# EAGLE schematic DA_uno_shield_3_0 (EAGLE 7.5.0)
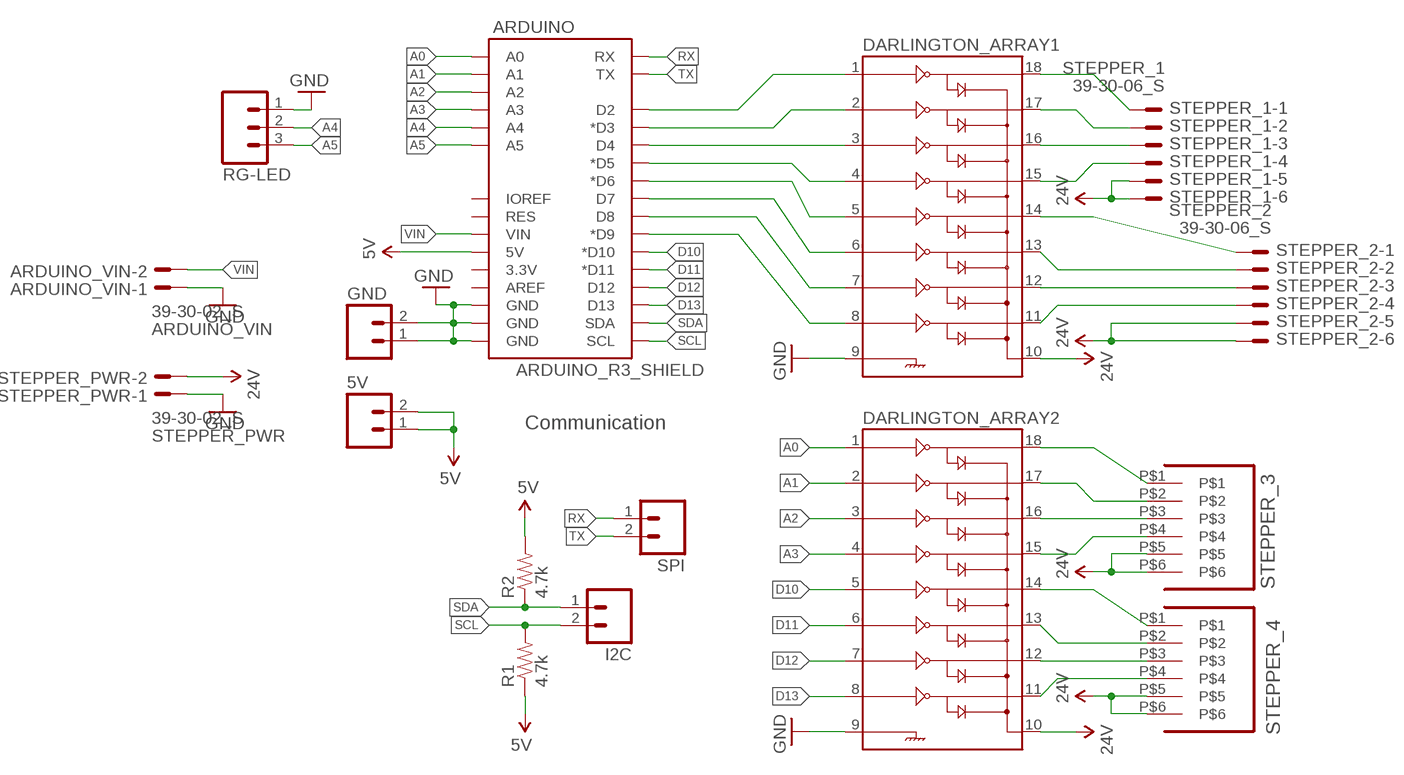
[diagram p0: schematic, sheet 1]

## Parts
5V  M021X02_NO_SILK  [1X02_NO_SILK]
ARDUINO  ARDUINO_R3_SHIELD  [UNO_R3_SHIELD]
ARDUINO_VIN  39-30-02_S  [39-30-?02?]
DARLINGTON_ARRAY1  ULN2803DIP  [DIL18]
DARLINGTON_ARRAY2  ULN2803DIP  [DIL18]
GND  M021X02_NO_SILK  [1X02_NO_SILK]
I2C  M021X02_NO_SILK  [1X02_NO_SILK]
R1  4.7k  RESISTORKIT  [AXIAL-0.3-KIT]
R2  4.7k  RESISTORKIT  [AXIAL-0.3-KIT]
RG-LED  M03LOCK_NO_SILK  [1X03_LOCK_NO_SILK]
SPI  M021X02_NO_SILK  [1X02_NO_SILK]
STEPPER_1  39-30-06_S  [39-30-?06?]
STEPPER_2  39-30-06_S  [39-30-?06?]
STEPPER_3  39-29-06  [39-29-?06?]
STEPPER_4  39-29-06  [39-29-?06?]
STEPPER_PWR  39-30-02_S  [39-30-?02?]

## Nets
5V: 5V.1 5V.2 ARDUINO.5V R1.P$1 R2.P$2
A0: ARDUINO.A0 DARLINGTON_ARRAY2.1
A1: ARDUINO.A1 DARLINGTON_ARRAY2.2
A2: ARDUINO.A2 DARLINGTON_ARRAY2.3
A3: ARDUINO.A3 DARLINGTON_ARRAY2.4
A4: ARDUINO.A4 RG-LED.2
A5: ARDUINO.A5 RG-LED.3
D10: ARDUINO.D10(*D10) DARLINGTON_ARRAY2.5
D11: ARDUINO.D11(*D11) DARLINGTON_ARRAY2.6
D12: ARDUINO.D12 DARLINGTON_ARRAY2.7
D13: ARDUINO.D13 DARLINGTON_ARRAY2.8
GND: ARDUINO.GND@0(GND) ARDUINO.GND@1(GND) ARDUINO.GND@2(GND) ARDUINO_VIN.1 DARLINGTON_ARRAY1.9 DARLINGTON_ARRAY2.9 GND.1 GND.2 RG-LED.1 STEPPER_PWR.1
N$1: DARLINGTON_ARRAY1.14 STEPPER_2.1
N$2: DARLINGTON_ARRAY1.13 STEPPER_2.2
N$3: DARLINGTON_ARRAY1.12 STEPPER_2.3
N$4: DARLINGTON_ARRAY1.11 STEPPER_2.4
N$5: ARDUINO.D6(*D6) DARLINGTON_ARRAY1.5
N$6: ARDUINO.D7 DARLINGTON_ARRAY1.6
N$7: ARDUINO.D8 DARLINGTON_ARRAY1.7
N$8: ARDUINO.D9(*D9) DARLINGTON_ARRAY1.8
N$30: DARLINGTON_ARRAY2.18 STEPPER_3.P$1
N$33: ARDUINO.D2 DARLINGTON_ARRAY1.1
N$34: DARLINGTON_ARRAY1.18 STEPPER_1.1
N$35: DARLINGTON_ARRAY1.17 STEPPER_1.2
N$36: DARLINGTON_ARRAY1.16 STEPPER_1.3
N$37: DARLINGTON_ARRAY1.15 STEPPER_1.4
N$38: ARDUINO.D3(*D3) DARLINGTON_ARRAY1.2
N$39: ARDUINO.D4 DARLINGTON_ARRAY1.3
N$40: ARDUINO.D5(*D5) DARLINGTON_ARRAY1.4
N$41: DARLINGTON_ARRAY2.17 STEPPER_3.P$2
N$42: DARLINGTON_ARRAY2.16 STEPPER_3.P$3
N$43: DARLINGTON_ARRAY2.15 STEPPER_3.P$4
N$44: DARLINGTON_ARRAY2.14 STEPPER_4.P$1
N$45: DARLINGTON_ARRAY2.13 STEPPER_4.P$2
N$46: DARLINGTON_ARRAY2.12 STEPPER_4.P$3
N$47: DARLINGTON_ARRAY2.11 STEPPER_4.P$4
RX: ARDUINO.RX SPI.1
SCL: ARDUINO.SCL I2C.2 R1.P$2
SDA: ARDUINO.SDA I2C.1 R2.P$1
TX: ARDUINO.TX SPI.2
VCC: DARLINGTON_ARRAY1.10 DARLINGTON_ARRAY2.10 STEPPER_1.5 STEPPER_1.6 STEPPER_2.5 STEPPER_2.6 STEPPER_3.P$5 STEPPER_3.P$6 STEPPER_4.P$5 STEPPER_4.P$6 STEPPER_PWR.2 ; supply symbol labelled 24V
VIN: ARDUINO.VIN ARDUINO_VIN.2
Unconnected: ARDUINO.3.3V ARDUINO.AREF ARDUINO.IOREF ARDUINO.RES

## Notes on the sheet
- Communication

## Library data of the parts
5V GND I2C SPI = SparkFun-Connectors:M02: Standard 2-pin 0.1" header. Use with - straight break away headers ( PRT-00116) - right angle break away headers (PRT-00553) - swiss pins (PRT-00743) - machine pins (PRT-00117) - female headers (PRT-00115) Molex polarized connector foot print use with: PRT-08233 with associated crimp pins and housings. 2.54_SCREWTERM for use with PRT-10571. 3.5mm Screw Terminal footprints for PRT-08084 5mm Screw Terminal footprints for use with PRT-08432
ARDUINO = Nathans-Arduinos:ARDUINO_R3_SHIELD: Shield form compatible with the Arduino Uno R3.
ARDUINO_VIN STEPPER_PWR = MTIID-molex-mini-fit-with-some-vertical:39-30-?02?_S: HEADER
DARLINGTON_ARRAY1 DARLINGTON_ARRAY2 = SparkFun-PowerIC:ULN2803: Darlington Driver ULN2803 Darlington array. 500mA max per channel, 8-channel package. Spark Fun Electronics SKU : COM-00312
R1 R2 = SparkFun-Resistors:RESISTOR: Resistor Basic schematic elements and footprints for 0603, 1206, and PTH resistors.
RG-LED = SparkFun-Connectors:M03: Header 3 Standard 3-pin 0.1" header. Use with straight break away headers (SKU : PRT-00116), right angle break away headers (PRT-00553), swiss pins (PRT-00743), machine pins (PRT-00117), and female headers (PRT-00115). Molex polarized connector foot print use with SKU : PRT-08232 with associated crimp pins and housings.
STEPPER_1 STEPPER_2 = MTIID-molex-mini-fit-with-some-vertical:39-30-?06?_S: HEADER
STEPPER_3 STEPPER_4 = MTIID-molex-mini-fit-with-some-vertical:39-29-?06?

## Net classes
0 default: width 0.813 mm, drill 0.381 mm, clearance 0.381 mm
1 GND: width 0.508 mm, drill 0.508 mm, clearance 0.406 mm